# EAGLE design Work In Progress (EAGLE 9.6.2)
CNAME: HAL Circuitry; CREVISION: 0.9; DESIGNER: Thomas G and Andrew F

## Sheet 1 of 5: Arduino and Proto-boards
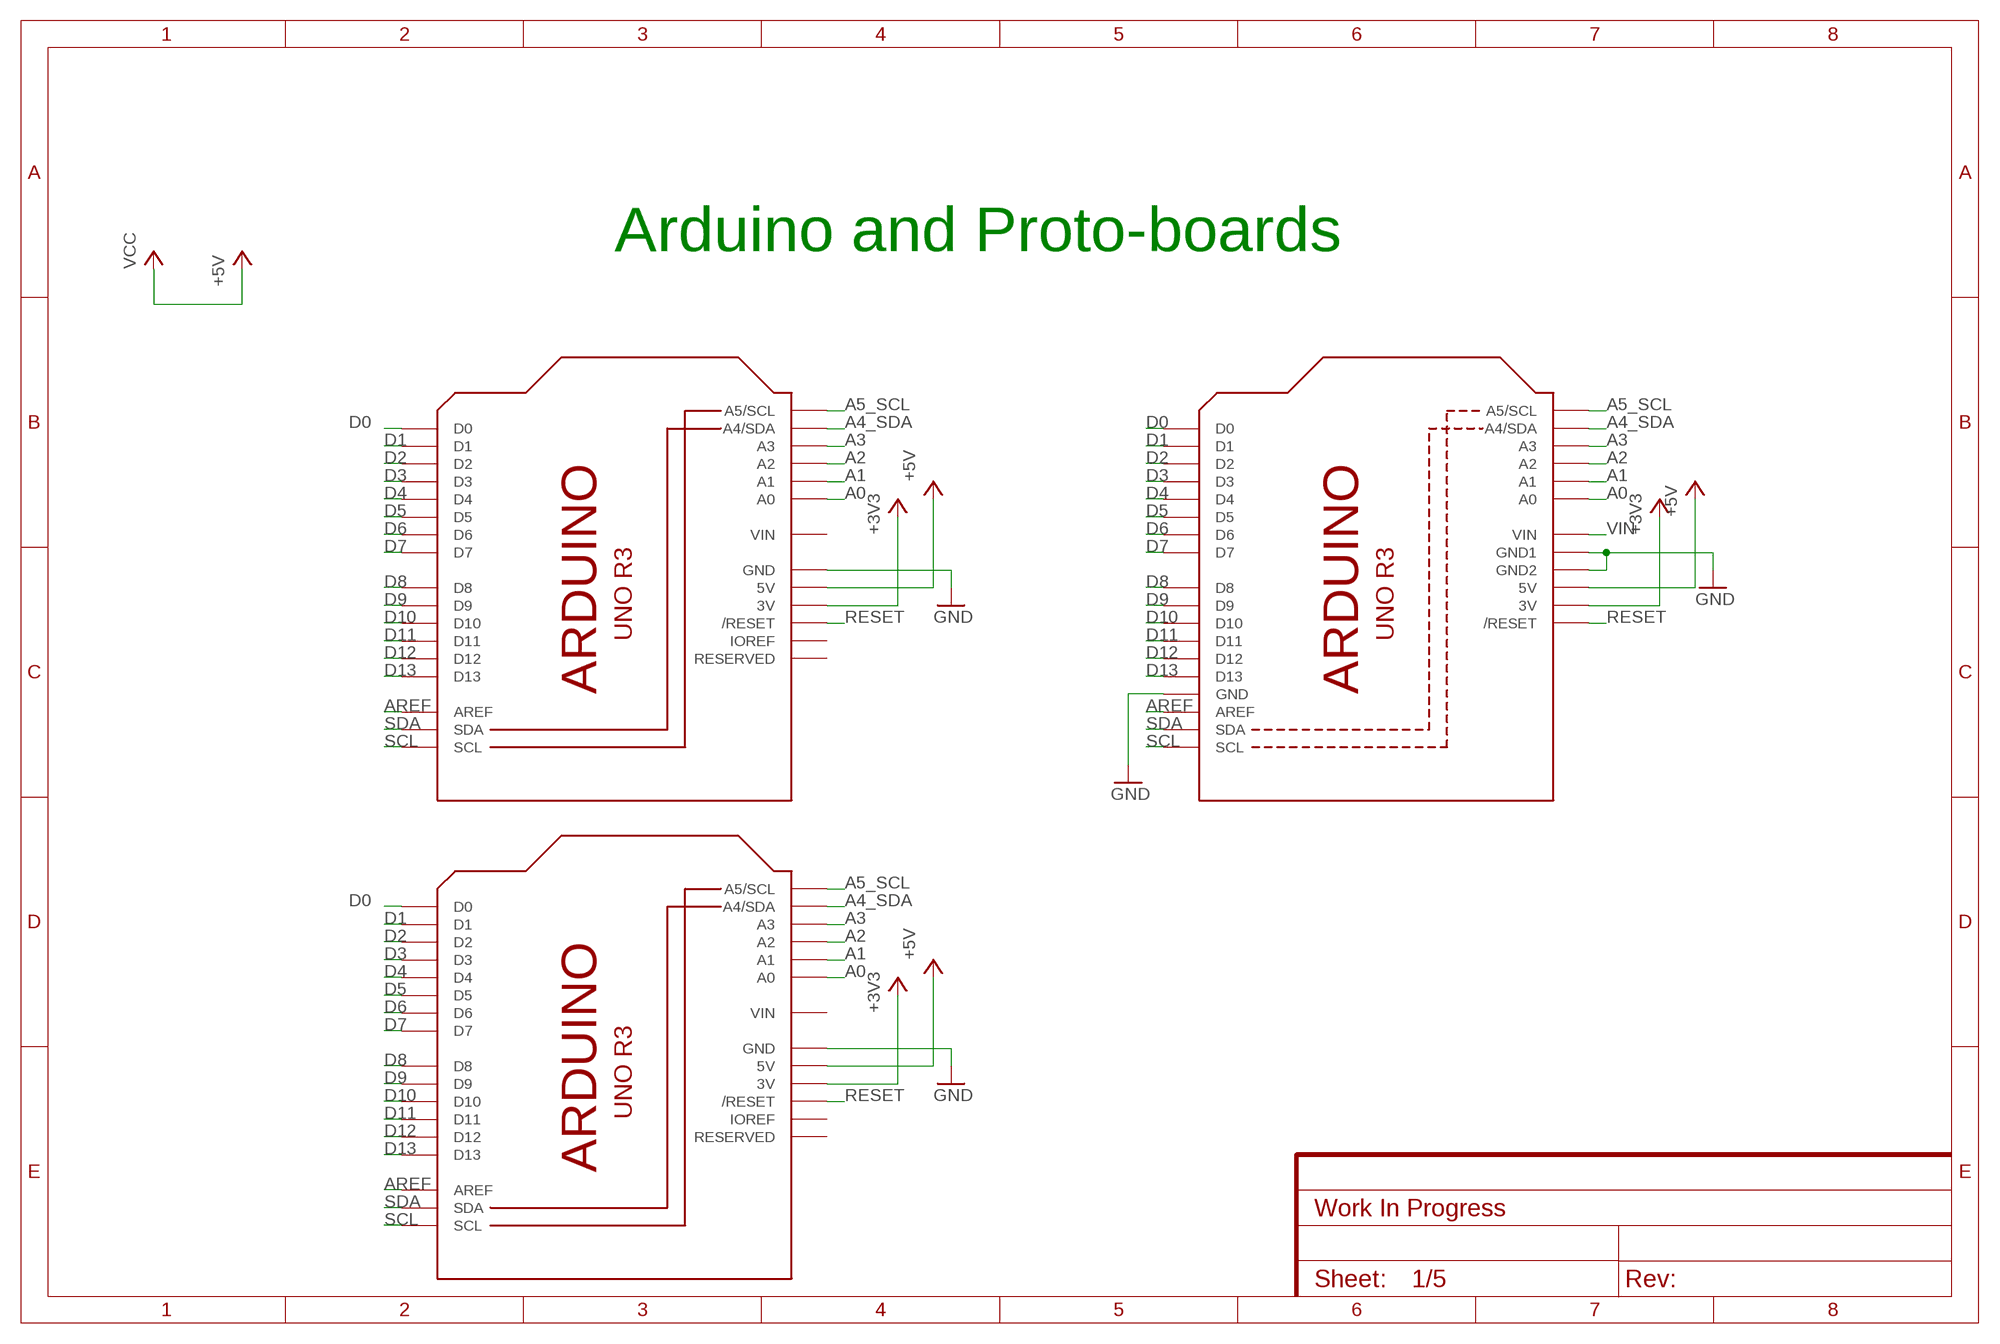
[diagram p0: schematic, sheet 1]

### Parts
M1  IDP_PROTOBOARD_LARGE_LARGE  [IDP_PROTO_LARGE]
M2  IDP_PROTOBOARD_LARGE_LARGE  [IDP_PROTO_LARGE]
Q1  ARDUINOR3-NOIOREF-NOTEXT  [ARDUINOR3-NOTEXT-NOIOREF]

### Nets
+3V3: M1.3V M2.3V Q1.3V
+5V: M1.5V M1.5V@0(5V) M1.5V@1(5V) M1.5V@2(5V) M1.5V@3(5V) M1.5V@4(5V) M1.5V@5(5V) M1.5V@6(5V) M1.5V@7(5V) M1.5V@8(5V) M1.5V@9(5V) M1.5V@10(5V) M1.5V@11(5V) M1.5V@12(5V) M1.5V@13(5V) M1.5V@14(5V) M1.5V@15(5V) M1.5V@16(5V) M1.5V@17(5V) M1.5V@18(5V) M1.5V@19(5V) M1.5V@20(5V) M1.5V@21(5V) M1.5V@22(5V) M1.5V@23(5V) M1.5V@24(5V) M1.5V@25(5V) M1.5V@26(5V) M1.5V@27(5V) M1.5V@28(5V) M1.5V@29(5V) M1.5V@30(5V) M1.5V@31(5V) M1.5V@32(5V) M1.5V@33(5V) M1.5V@34(5V) M1.5V@35(5V) M1.5V@36(5V) M1.5V@37(5V) M1.5V@38(5V) M1.5V@39(5V) M1.5V@40(5V) M1.5V@41(5V) M1.5V@42(5V) M1.5V@43(5V) M1.5V@44(5V) M1.5V@45(5V) M1.5V@46(5V) M1.5V@47(5V) M1.5V@48(5V) M1.5V@49(5V) M1.5V@50(5V) M1.5V@51(5V) M1.5V@52(5V) M1.5V@53(5V) M1.5V@54(5V) M1.5V@55(5V) M1.5V@56(5V) M1.5V@57(5V) M1.5V@58(5V) M1.5V@59(5V) M1.5V@60(5V) M1.5V@61(5V) M1.5V@62(5V) M1.5V@63(5V) M1.5V@64(5V) M1.5V@65(5V) M1.5V@66(5V) M1.5V@67(5V) M1.5V@68(5V) M1.5V@69(5V) M1.5V@70(5V) M2.5V M2.5V@0(5V) M2.5V@1(5V) M2.5V@2(5V) M2.5V@3(5V) M2.5V@4(5V) M2.5V@5(5V) M2.5V@6(5V) M2.5V@7(5V) M2.5V@8(5V) M2.5V@9(5V) M2.5V@10(5V) M2.5V@11(5V) M2.5V@12(5V) M2.5V@13(5V) M2.5V@14(5V) M2.5V@15(5V) M2.5V@16(5V) M2.5V@17(5V) M2.5V@18(5V) M2.5V@19(5V) M2.5V@20(5V) M2.5V@21(5V) M2.5V@22(5V) M2.5V@23(5V) M2.5V@24(5V) M2.5V@25(5V) M2.5V@26(5V) M2.5V@27(5V) M2.5V@28(5V) M2.5V@29(5V) M2.5V@30(5V) M2.5V@31(5V) M2.5V@32(5V) M2.5V@33(5V) M2.5V@34(5V) M2.5V@35(5V) M2.5V@36(5V) M2.5V@37(5V) M2.5V@38(5V) M2.5V@39(5V) M2.5V@40(5V) M2.5V@41(5V) M2.5V@42(5V) M2.5V@43(5V) M2.5V@44(5V) M2.5V@45(5V) M2.5V@46(5V) M2.5V@47(5V) M2.5V@48(5V) M2.5V@49(5V) M2.5V@50(5V) M2.5V@51(5V) M2.5V@52(5V) M2.5V@53(5V) M2.5V@54(5V) M2.5V@55(5V) M2.5V@56(5V) M2.5V@57(5V) M2.5V@58(5V) M2.5V@59(5V) M2.5V@60(5V) M2.5V@61(5V) M2.5V@62(5V) M2.5V@63(5V) M2.5V@64(5V) M2.5V@65(5V) M2.5V@66(5V) M2.5V@67(5V) M2.5V@68(5V) M2.5V@69(5V) M2.5V@70(5V) Q1.5V ; supply symbol labelled VCC ; also sheet 2,3,4
A0: M1.A0 M2.A0 Q1.A0
A1: M1.A1 M2.A1 Q1.A1
A2: M1.A2 M2.A2 Q1.A2
A3: M1.A3 M2.A3 Q1.A3
A4_SDA: M1.A4(A4/SDA) M2.A4(A4/SDA) Q1.A4(A4/SDA)
A5_SCL: M1.A5(A5/SCL) M2.A5(A5/SCL) Q1.A5(A5/SCL)
AREF: M1.AREF M2.AREF Q1.AREF
D0: M1.D0 M2.D0 Q1.D0
D1: M1.D1 M2.D1 Q1.D1 ; also sheet 4
D2: M1.D2 M2.D2 Q1.D2 ; also sheet 2,4
D3: M1.D3 M2.D3 Q1.D3 ; also sheet 4
D4: M1.D4 M2.D4 Q1.D4 ; also sheet 4
D5: M1.D5 M2.D5 Q1.D5
D6: M1.D6 M2.D6 Q1.D6
D7: M1.D7 M2.D7 Q1.D7
D8: M1.D8 M2.D8 Q1.D8 ; also sheet 3
D9: M1.D9 M2.D9 Q1.D9 ; also sheet 3
D10: M1.D10 M2.D10 Q1.D10 ; also sheet 3
D11: M1.D11 M2.D11 Q1.D11 ; also sheet 3
D12: M1.D12 M2.D12 Q1.D12
D13: M1.D13 M2.D13 Q1.D13
GND: M1.GND M1.GND1(GND) M1.GND2(GND) M1.GND3(GND) M1.GND4(GND) M1.GND5(GND) M1.GND6(GND) M1.GND7(GND) M1.GND8(GND) M1.GND9(GND) M1.GND10(GND) M1.GND11(GND) M1.GND12(GND) M1.GND13(GND) M1.GND14(GND) M1.GND15(GND) M1.GND16(GND) M1.GND17(GND) M1.GND18(GND) M1.GND19(GND) M1.GND20(GND) M1.GND21(GND) M1.GND22(GND) M1.GND23(GND) M1.GND24(GND) M1.GND25(GND) M1.GND26(GND) M1.GND27(GND) M1.GND28(GND) M1.GND29(GND) M1.GND30(GND) M1.GND31(GND) M1.GND32(GND) M1.GND33(GND) M1.GND@1(GND) M1.GND@2(GND) M1.GND@3(GND) M1.GND@4(GND) M1.GND@5(GND) M1.GND@6(GND) M1.GND@7(GND) M1.GND@8(GND) M1.GND@9(GND) M1.GND@10(GND) M1.GND@11(GND) M1.GND@12(GND) M1.GND@13(GND) M1.GND@14(GND) M1.GND@15(GND) M1.GND@16(GND) M1.GND@17(GND) M1.GND@26(GND) M1.GND@27(GND) M1.GND@28(GND) M1.GND@29(GND) M1.GND@30(GND) M1.GND@31(GND) M1.GND@32(GND) M1.GND@33(GND) M1.GND@34(GND) M1.GND@35(GND) M1.GND@36(GND) M1.GND@37(GND) M1.GND@38(GND) M1.GND@39(GND) M1.GND@40(GND) M1.GND@41(GND) M1.GND@42(GND) M1.GND@43(GND) M1.GND@44(GND) M1.GND@45(GND) M1.GND@46(GND) M1.GND@47(GND) M1.GND@48(GND) M2.GND M2.GND1(GND) M2.GND2(GND) M2.GND3(GND) M2.GND4(GND) M2.GND5(GND) M2.GND6(GND) M2.GND7(GND) M2.GND8(GND) M2.GND9(GND) M2.GND10(GND) M2.GND11(GND) M2.GND12(GND) M2.GND13(GND) M2.GND14(GND) M2.GND15(GND) M2.GND16(GND) M2.GND17(GND) M2.GND18(GND) M2.GND19(GND) M2.GND20(GND) M2.GND21(GND) M2.GND22(GND) M2.GND23(GND) M2.GND24(GND) M2.GND25(GND) M2.GND26(GND) M2.GND27(GND) M2.GND28(GND) M2.GND29(GND) M2.GND30(GND) M2.GND31(GND) M2.GND32(GND) M2.GND33(GND) M2.GND@1(GND) M2.GND@2(GND) M2.GND@3(GND) M2.GND@4(GND) M2.GND@5(GND) M2.GND@6(GND) M2.GND@7(GND) M2.GND@8(GND) M2.GND@9(GND) M2.GND@10(GND) M2.GND@11(GND) M2.GND@12(GND) M2.GND@13(GND) M2.GND@14(GND) M2.GND@15(GND) M2.GND@16(GND) M2.GND@17(GND) M2.GND@26(GND) M2.GND@27(GND) M2.GND@28(GND) M2.GND@29(GND) M2.GND@30(GND) M2.GND@31(GND) M2.GND@32(GND) M2.GND@33(GND) M2.GND@34(GND) M2.GND@35(GND) M2.GND@36(GND) M2.GND@37(GND) M2.GND@38(GND) M2.GND@39(GND) M2.GND@40(GND) M2.GND@41(GND) M2.GND@42(GND) M2.GND@43(GND) M2.GND@44(GND) M2.GND@45(GND) M2.GND@46(GND) M2.GND@47(GND) M2.GND@48(GND) Q1.GND Q1.GND1 Q1.GND2 ; also sheet 2,3,4
RESET: M1.RESET(/RESET) M2.RESET(/RESET) Q1.RESET(/RESET)
SCL: M1.SCL M2.SCL Q1.SCL
SDA: M1.SDA M2.SDA Q1.SDA
VIN: Q1.VIN
Unconnected: M1.IOREF M1.RESERVED M1.VIN M2.IOREF M2.RESERVED M2.VIN

### Notes on the sheet
- Arduino and Proto-boards

## Sheet 2 of 5: 2Hz Amber LED Blinking Circuit
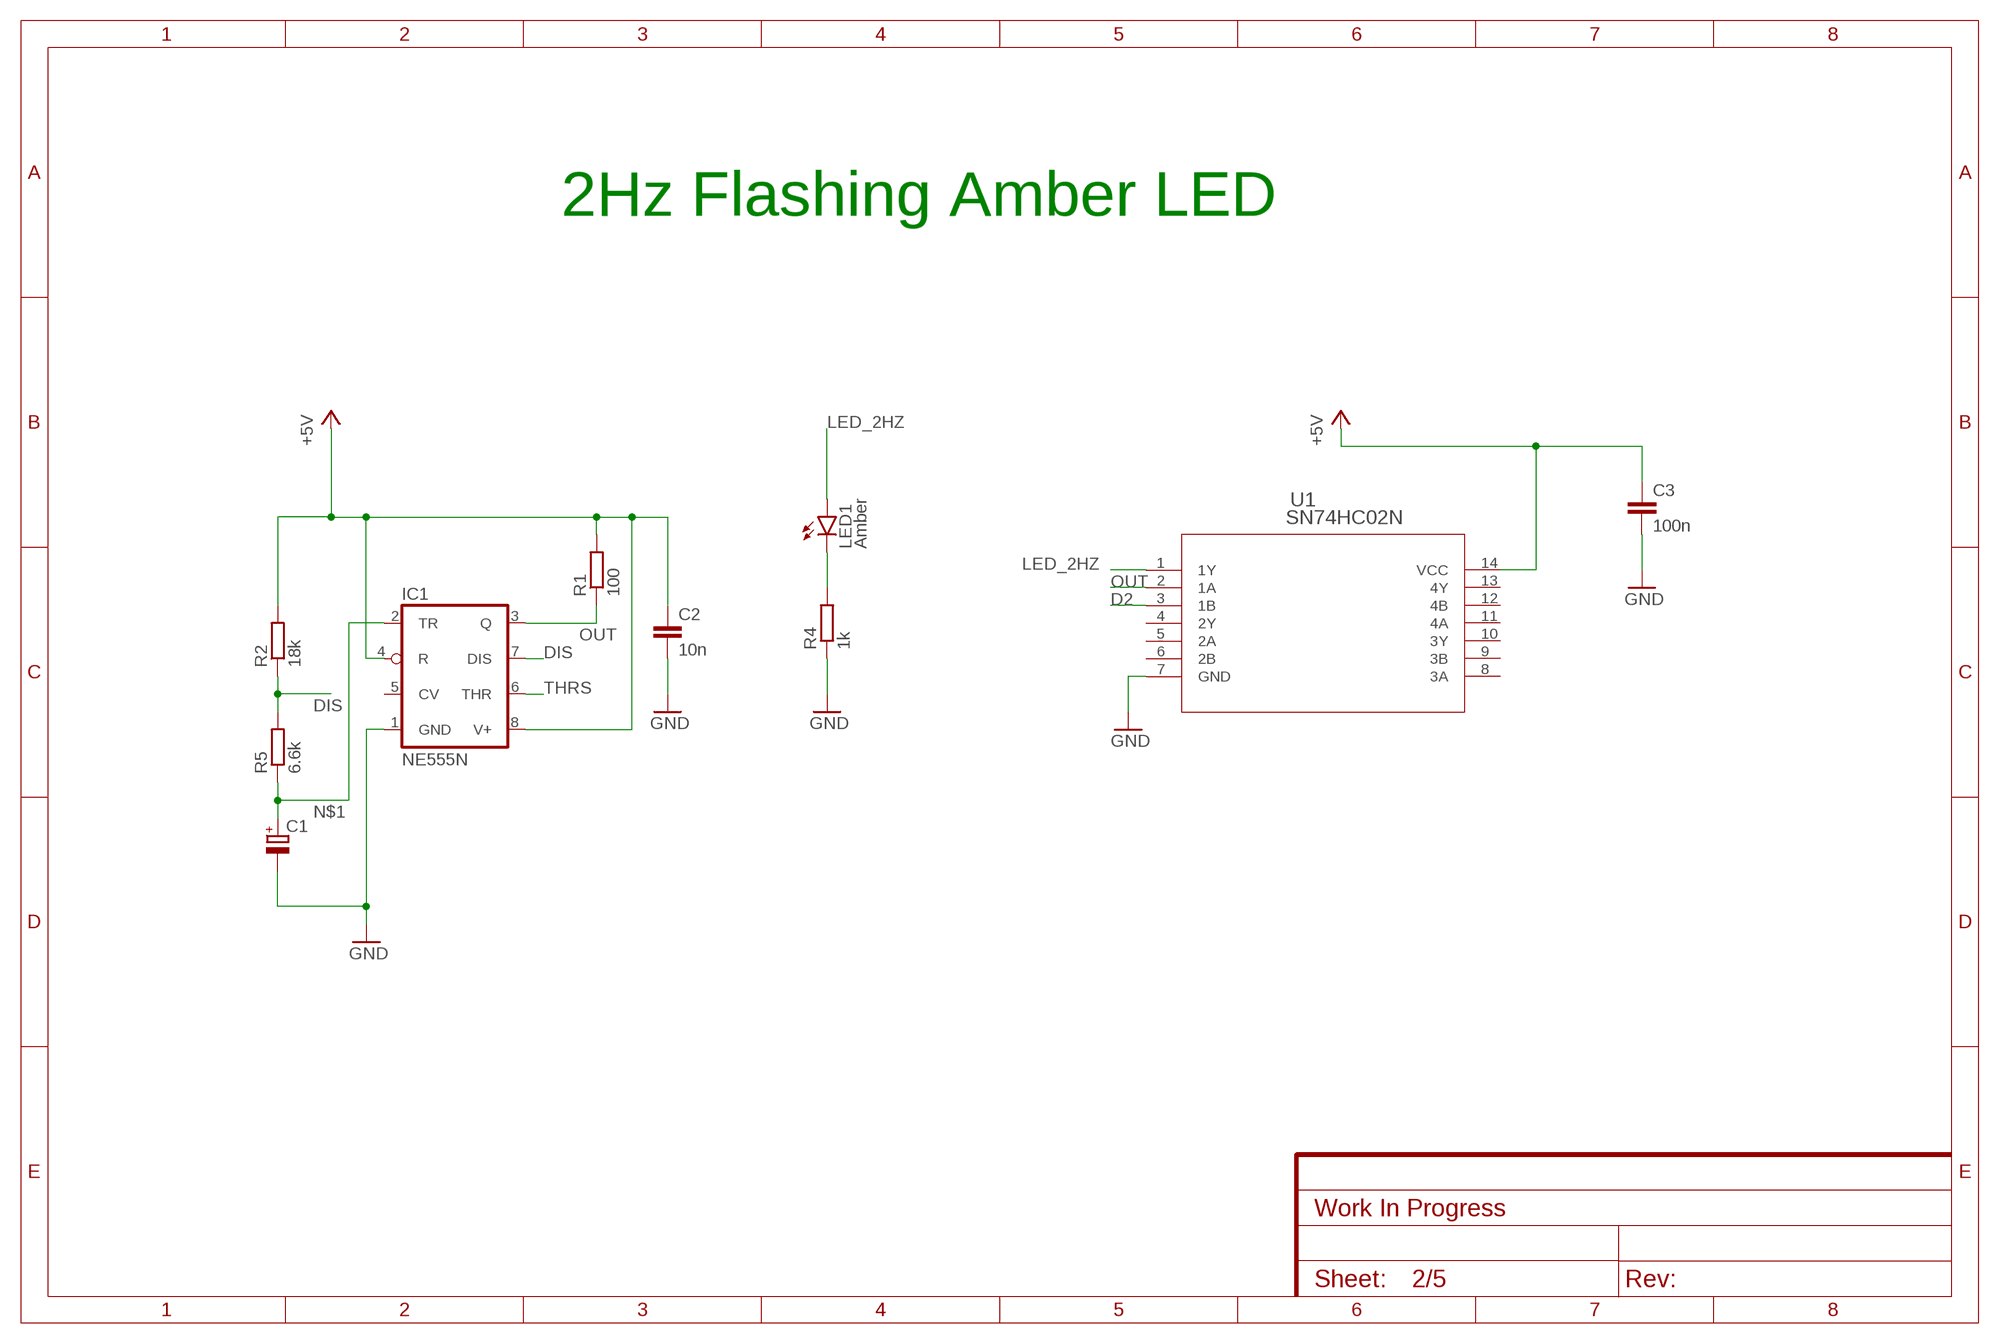
[diagram p1: schematic, sheet 2]

### Parts
C1  CPOL-EUTT2D4  [TT2D4]
C2  10n  C-EU025-024X044  [C025-024X044]
C3  100n  C-EU025-024X044  [C025-024X044]
IC1  NE555N  [DIL08-ROUND]
LED1  Amber  LED_23MM  [LED3MM]
R1  100  R-EU_0204/2V  [0204V]
R2  18k  R-EU_0204/2V  [0204V]
R4  1k  R-EU_0204/2V  [0204V]
R5  6.6k  R-EU_0204/2V  [0204V]
U1  SN74HC02N  [N14]

### Nets
+5V: C2.1 C3.1 IC1.4(R) IC1.8(V+) R1.2 R2.2 U1.14(VCC) ; also sheet 1,3,4
D2: U1.3(1B) ; also sheet 1,4
DIS: IC1.7(DIS) R2.1 R5.2
GND: C1.- C2.2 C3.2 IC1.1(GND) R4.1 U1.7(GND) ; also sheet 1,3,4
LED_2HZ: LED1.A U1.1(1Y)
N$1: C1.+ IC1.2(TR) R5.1
N$3: LED1.K(C) R4.2
OUT: IC1.3(Q) R1.1 U1.2(1A)
THRS: IC1.6(THR)
Unconnected: IC1.5(CV) U1.4(2Y) U1.5(2A) U1.6(2B) U1.8(3A) U1.9(3B) U1.10(3Y) U1.11(4A) U1.12(4B) U1.13(4Y)

### Notes on the sheet
- 2Hz Flashing Amber LED

## Sheet 3 of 5: Additional Sensors and Circuitry
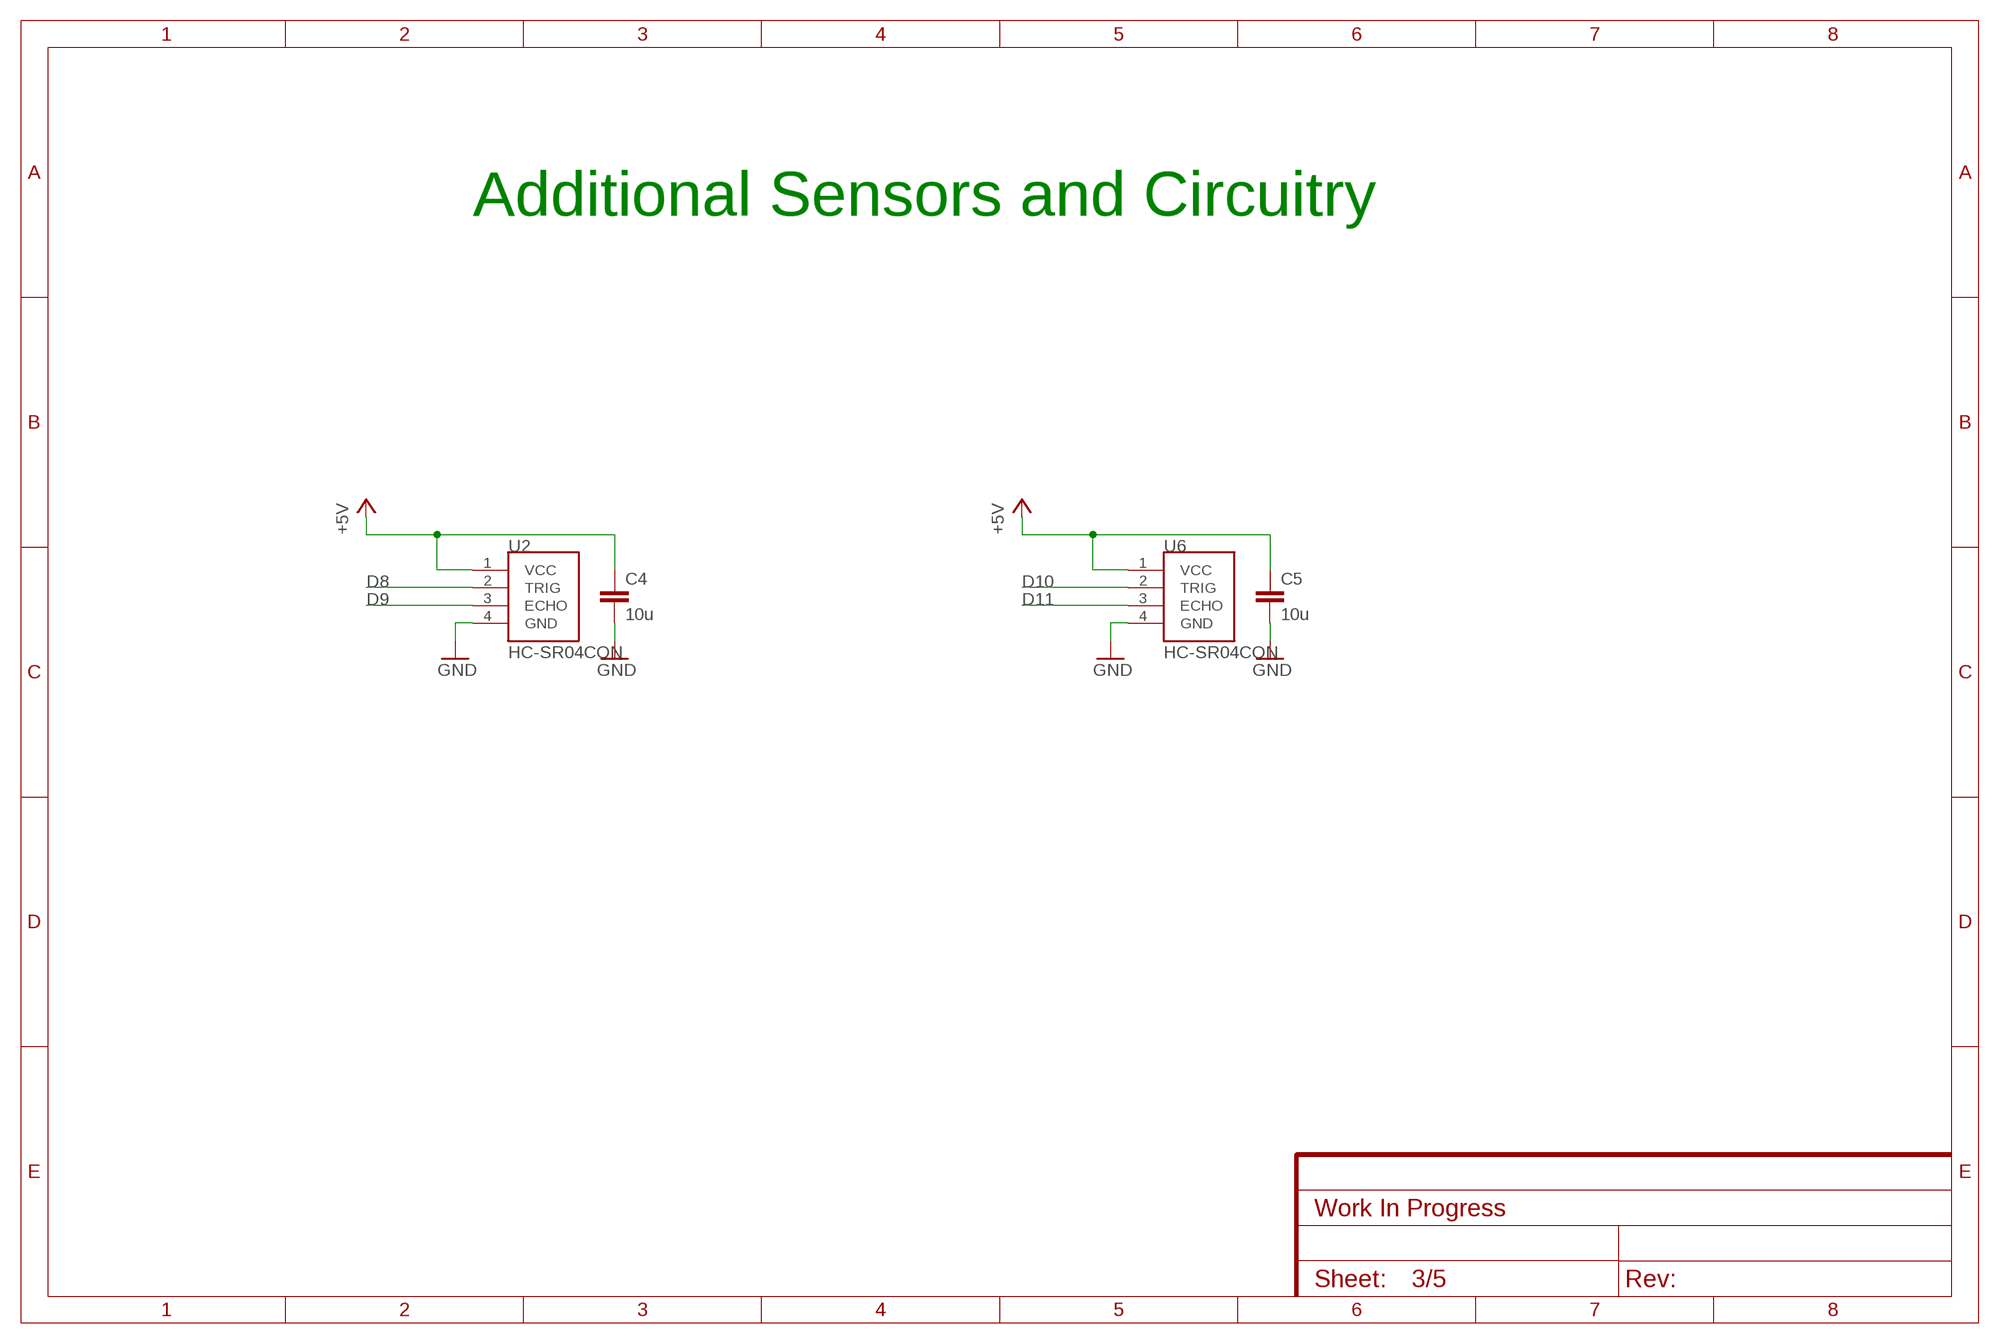
[diagram p2: schematic, sheet 3]

### Parts
C4  10u  C-EU025-024X044  [C025-024X044]
C5  10u  C-EU025-024X044  [C025-024X044]
U2  HC-SR04CON  [22-23-2041]
U6  HC-SR04CON  [22-23-2041]

### Nets
+5V: C4.1 C5.1 U2.1(VCC) U6.1(VCC) ; also sheet 1,2,4
D8: U2.2(TRIG) ; also sheet 1
D9: U2.3(ECHO) ; also sheet 1
D10: U6.2(TRIG) ; also sheet 1
D11: U6.3(ECHO) ; also sheet 1
GND: C4.2 C5.2 U2.4(GND) U6.4(GND) ; also sheet 1,2,4

### Notes on the sheet
- Additional Sensors and Circuitry

## Sheet 4 of 5: Line Following
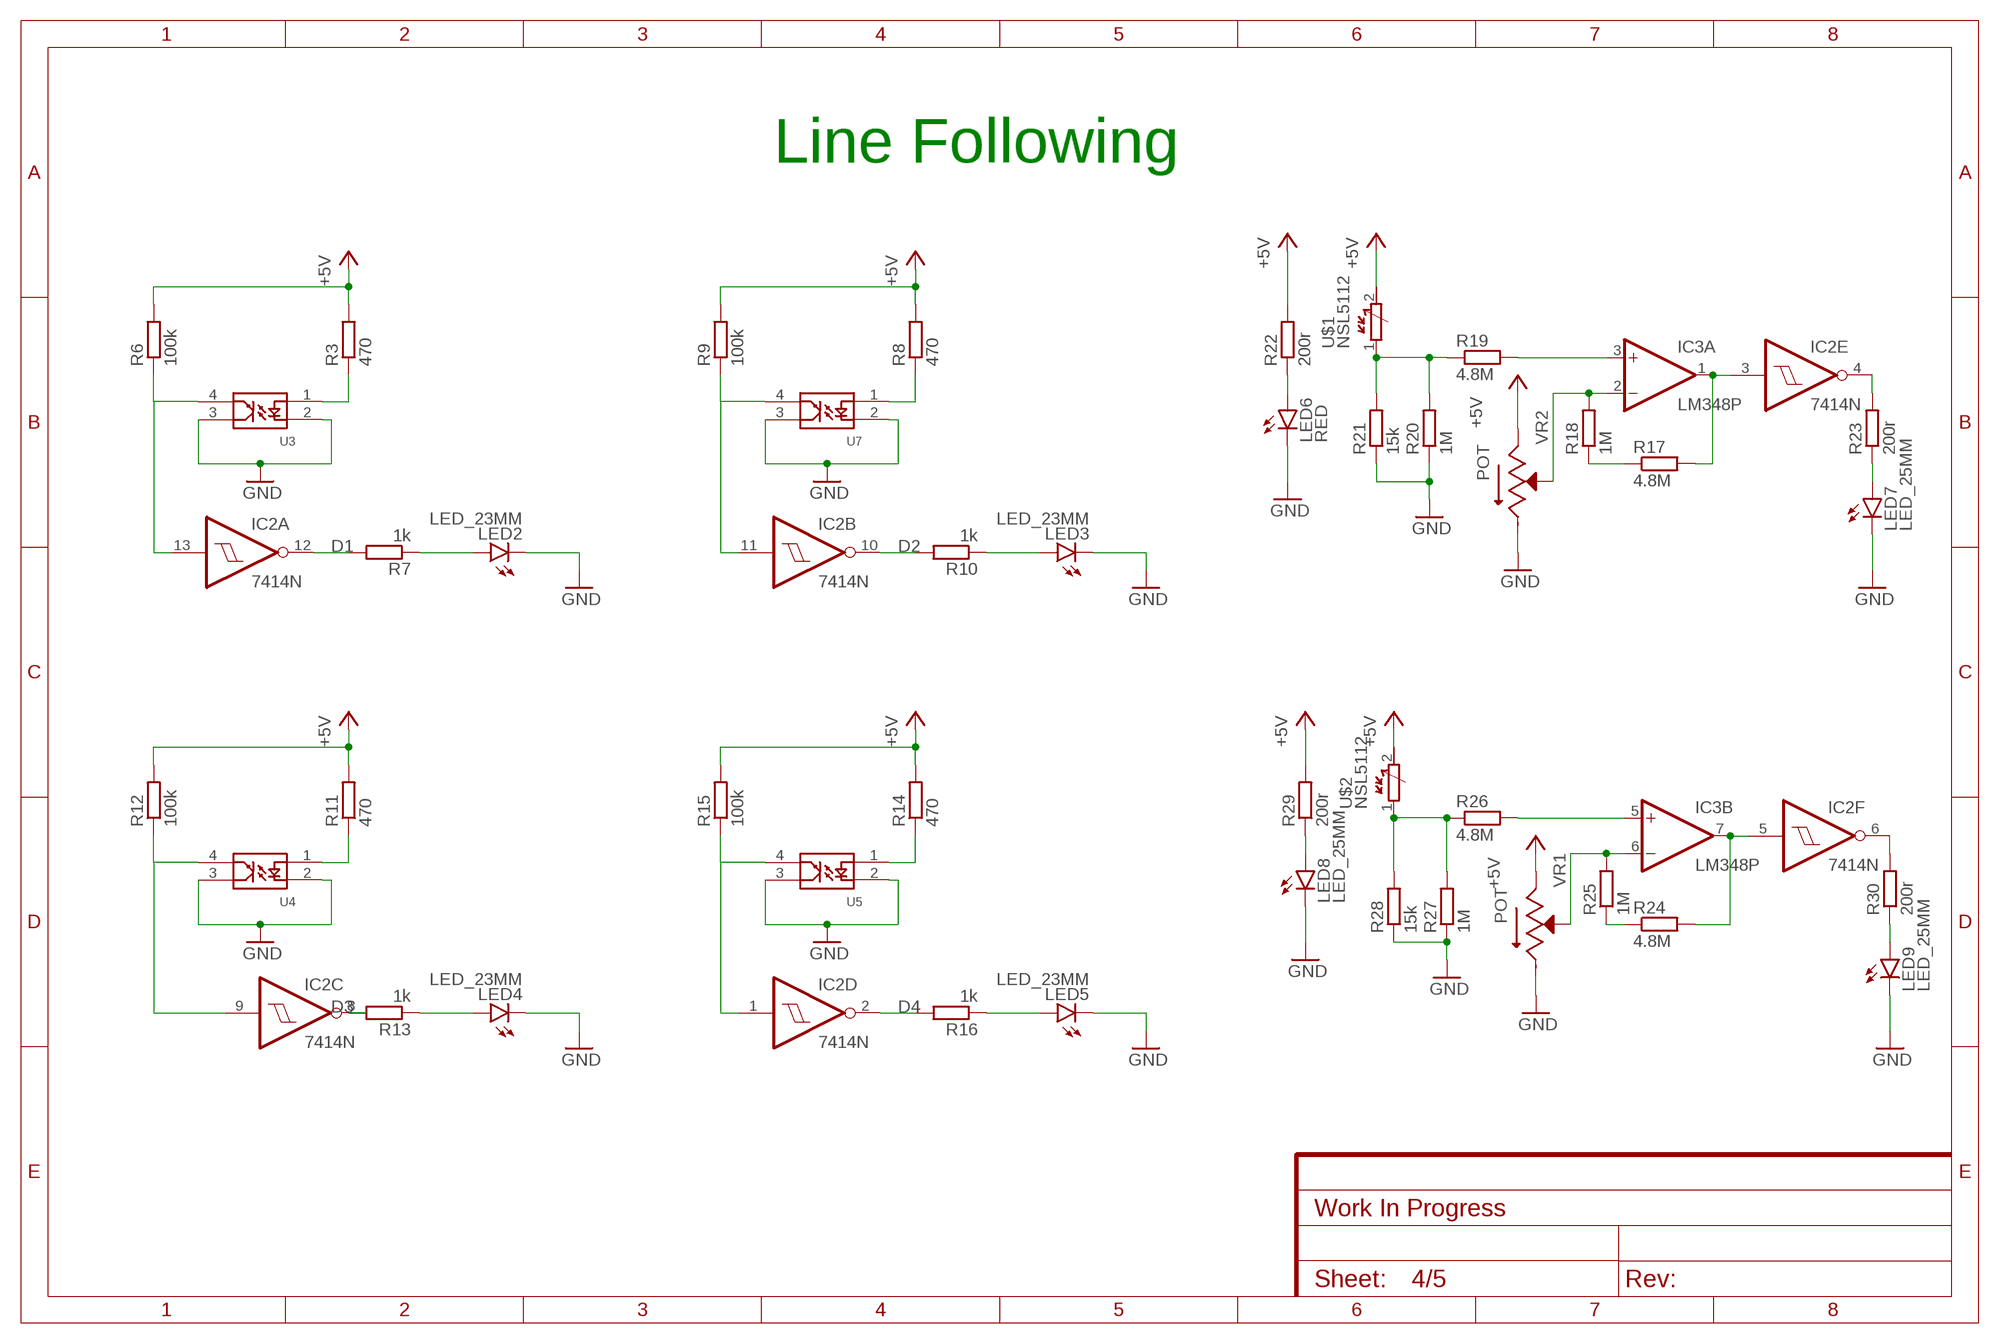
[diagram p3: schematic, sheet 4]

### Parts
IC2  7414N  [DIL14]
IC3  LM348P  [DIL14]
LED2  LED_23MM  [LED3MM]
LED3  LED_23MM  [LED3MM]
LED4  LED_23MM  [LED3MM]
LED5  LED_23MM  [LED3MM]
LED6  RED  LED_25MM  [LED5MM]
LED7  LED_25MM  [LED5MM]
LED8  LED_25MM  [LED5MM]
LED9  LED_25MM  [LED5MM]
R3  470  R-EU_0204/2V  [0204V]
R6  100k  R-EU_0204/2V  [0204V]
R7  1k  R-EU_0204/2V  [0204V]
R8  470  R-EU_0204/2V  [0204V]
R9  100k  R-EU_0204/2V  [0204V]
R10  1k  R-EU_0204/2V  [0204V]
R11  470  R-EU_0204/2V  [0204V]
R12  100k  R-EU_0204/2V  [0204V]
R13  1k  R-EU_0204/2V  [0204V]
R14  470  R-EU_0204/2V  [0204V]
R15  100k  R-EU_0204/2V  [0204V]
R16  1k  R-EU_0204/2V  [0204V]
R17  4.8M  R-EU_0204/2V  [0204V]
R18  1M  R-EU_0204/2V  [0204V]
R19  4.8M  R-EU_0204/2V  [0204V]
R20  1M  R-EU_0204/2V  [0204V]
R21  15k  R-EU_0204/2V  [0204V]
R22  200r  R-EU_0204/2V  [0204V]
R23  200r  R-EU_0204/2V  [0204V]
R24  4.8M  R-EU_0204/2V  [0204V]
R25  1M  R-EU_0204/2V  [0204V]
R26  4.8M  R-EU_0204/2V  [0204V]
R27  1M  R-EU_0204/2V  [0204V]
R28  15k  R-EU_0204/2V  [0204V]
R29  200r  R-EU_0204/2V  [0204V]
R30  200r  R-EU_0204/2V  [0204V]
U3  OPB704  [22-23-2041]
U4  OPB704  [22-23-2041]
U5  OPB704  [22-23-2041]
U7  OPB704  [22-23-2041]
U$1  NSL5112  [KK-156-2]
U$2  NSL5112  [KK-156-2]
VR1  POT  [TRIM_3296W-1-250]
VR2  POT  [TRIM_3296W-1-250]

### Nets
+5V: R3.2 R6.2 R8.2 R9.2 R11.2 R12.2 R14.2 R15.2 R22.2 R29.2 U$1.2(E) U$2.2(E) VR1.1(CCW) VR2.1(CCW) ; also sheet 1,2,3
D1: IC2.12(A:O) R7.2 ; also sheet 1
D2: IC2.10(B:O) R10.2 ; also sheet 1,2
D3: IC2.8(C:O) R13.2 ; also sheet 1
D4: IC2.2(D:O) R16.2 ; also sheet 1
GND: LED2.K(C) LED3.K(C) LED4.K(C) LED5.K(C) LED6.K(C) LED7.K(C) LED8.K(C) LED9.K(C) R20.1 R21.1 R27.1 R28.1 U3.2 U3.3 U4.2 U4.3 U5.2 U5.3 U7.2 U7.3 VR1.3(CW) VR2.3(CW) ; also sheet 1,2,3
N$2: R3.1 U3.1
N$4: LED2.A R7.1
N$5: IC2.13(A:I) R6.1 U3.4
N$6: R8.1 U7.1
N$7: IC2.11(B:I) R9.1 U7.4
N$8: LED3.A R10.1
N$9: R11.1 U4.1
N$10: IC2.9(C:I) R12.1 U4.4
N$11: LED4.A R13.1
N$12: R14.1 U5.1
N$13: IC2.1(D:I) R15.1 U5.4
N$14: LED5.A R16.1
N$15: R17.1 R18.1
N$16: IC2.3(E:I) IC3.1(A:OUT) R17.2
N$17: IC3.2(A:-IN) R18.2 VR2.2(WIPER)
N$18: IC3.3(A:+IN) R19.2
N$19: R19.1 R20.2 R21.2 U$1.1(A)
N$20: LED6.A R22.1
N$21: LED7.A R23.1
N$22: IC2.4(E:O) R23.2
N$23: R24.1 R25.1
N$24: IC2.5(F:I) IC3.7(B:OUT) R24.2
N$25: IC3.6(B:-IN) R25.2 VR1.2(WIPER)
N$26: IC3.5(B:+IN) R26.2
N$27: R26.1 R27.2 R28.2 U$2.1(A)
N$28: LED8.A R29.1
N$29: LED9.A R30.1
N$30: IC2.6(F:O) R30.2
Unconnected: IC3.8(C:OUT) IC3.9(C:-IN) IC3.10(C:+IN) IC3.12(D:+IN) IC3.13(D:-IN) IC3.14(D:OUT)

### Notes on the sheet
- Line Following

## Sheet 5 of 5: Colour Detection
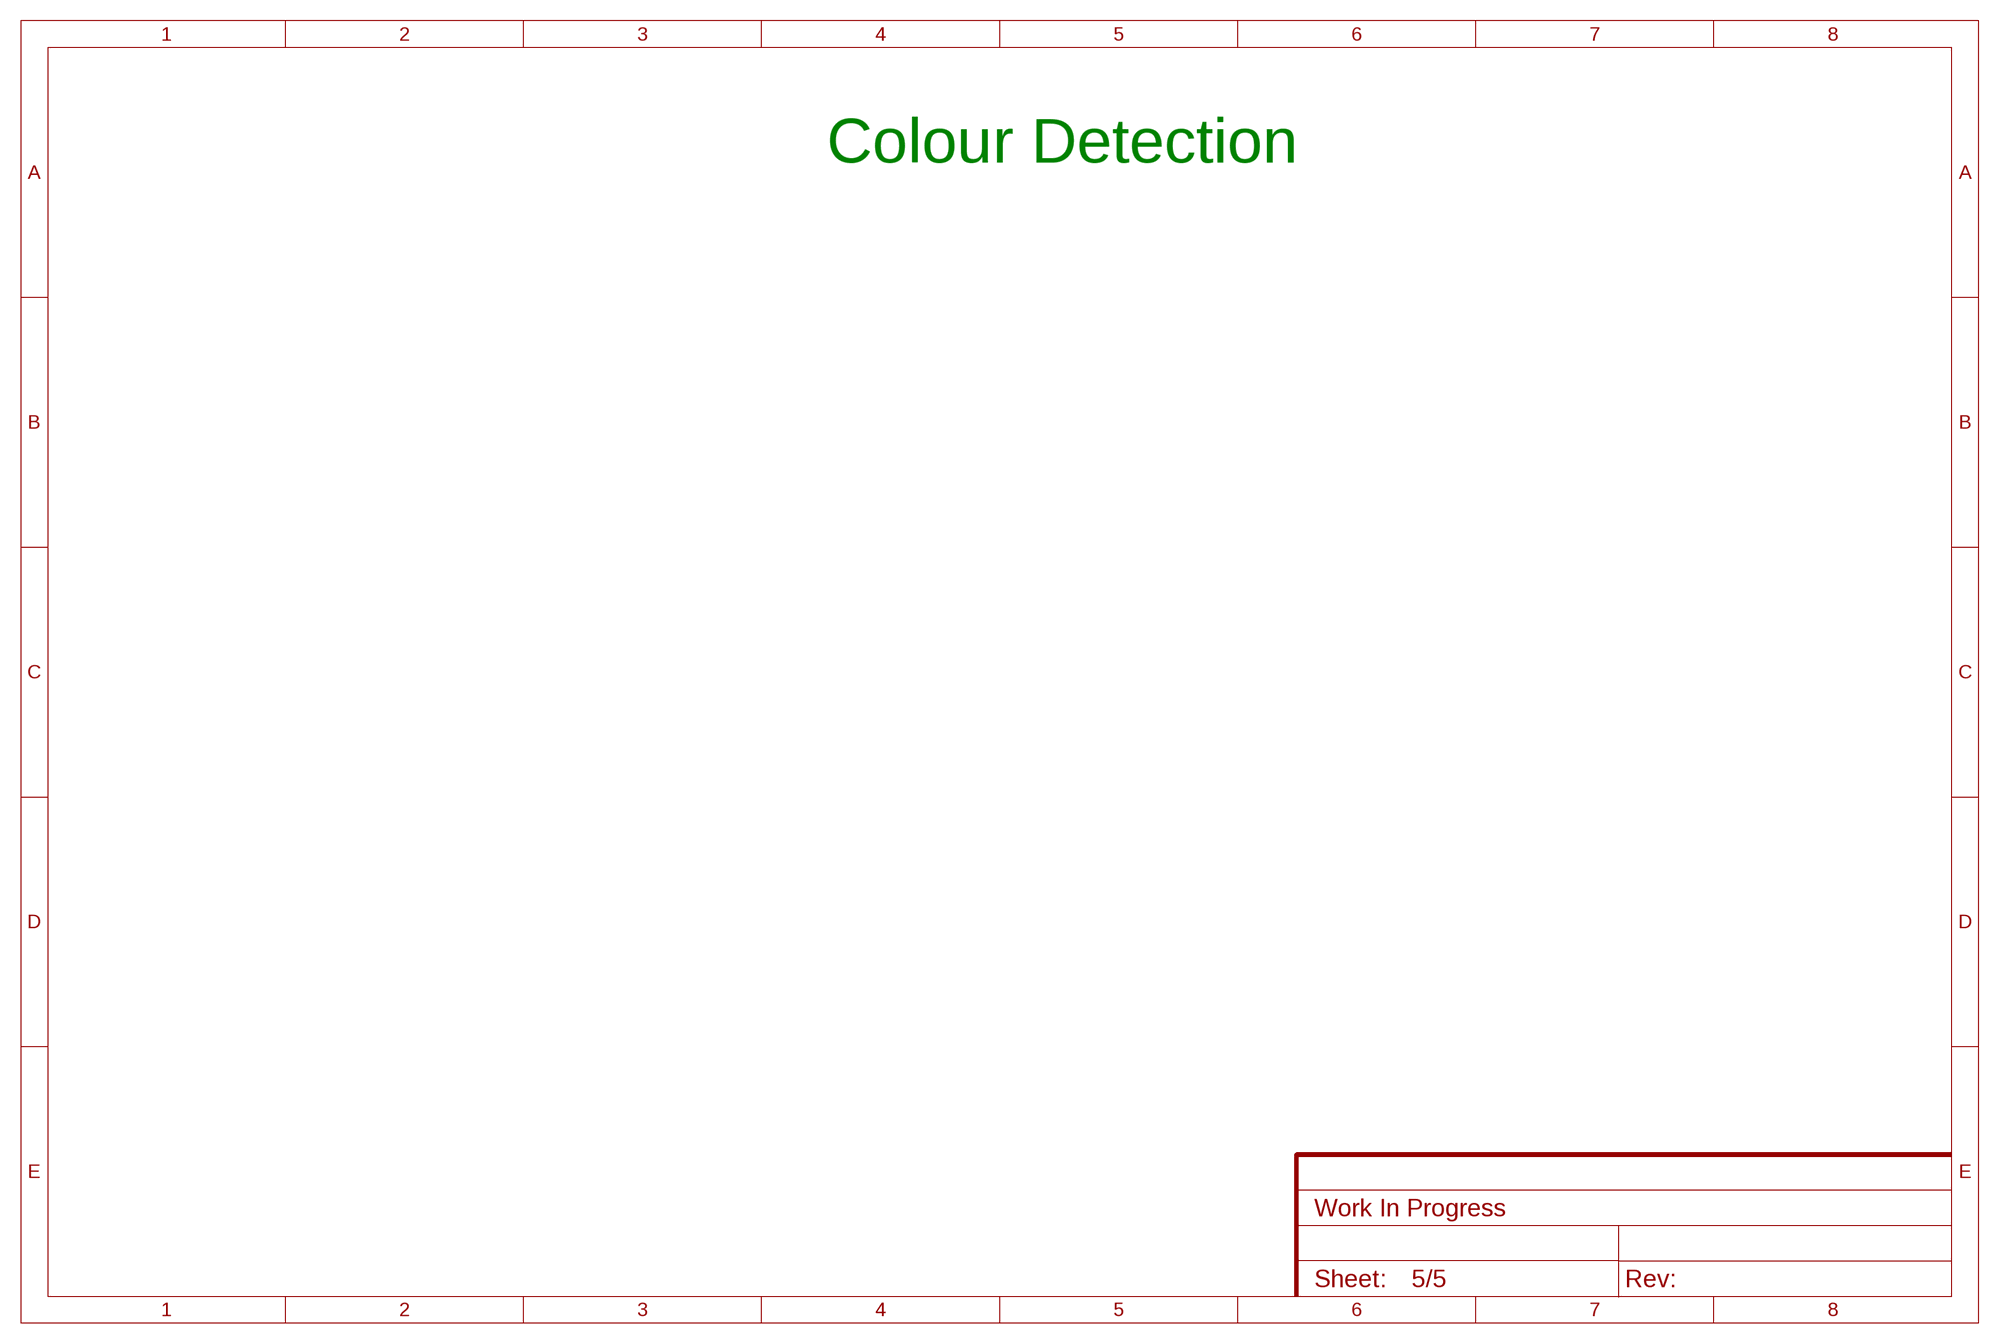
[diagram p4: schematic, sheet 5]

### Notes on the sheet
- Colour Detection

## Power pins joined to a net without a drawn wire
GND: IC2.7(P:GND)
V+: IC3.4(P:V+)
V-: IC3.11(P:V-)
VCC: IC2.14(P:VCC)

## Library data of the parts
C1 = IDP_library:CPOL-EU: POLARIZED CAPACITOR, European symbol; SPICEPREFIX: C
C2-C5 = IDP_library:C-EU: CAPACITOR, European symbol; SPICEPREFIX: C
IC1 = IDP_library:*555: TIMER Changed DIP package to have round (not oval) pin pads http://www.ladyada.net/library/pcb/eaglelibrary.html
IC2 = IDP_library:74*14: Hex schmitt trigger INVERTER
IC3 = IDP_library:LM348: Quad OP AMP
LED1-LED9 = IDP_library:LED_2: LED
M1 M2 = IDP_library:IDP_PROTOBOARD_LARGE
Q1 = IDP_library:ARDUINOR3-NOIOREF
R1-R30 = IDP_library:R-EU_: RESISTOR, European symbol; SPICEPREFIX: R
U1 = IDP_library:SN74HC02N; COPYRIGHT: Copyright (C) 2023 Ultra Librarian. All rights reserved.; MANUFACTURER_PART_NUMBER: SN74HC02N; MFR_NAME: Texas Instruments
U2 U6 = IDP_library:HC-SR04: Ultrasonic Sensor Module Check prices <https://pricing.snapeda.com/parts/HC-SR04/SparkFun%20Electronics/view-part?ref=eda>
U3-U5 U7 = IDP_library:OPB704: 314020022
U$1 U$2 = IDP_library:NSL5112
VR1 VR2 = IDP_library:POT: Res Cermet Trimmer 500K Ohm 10% 0.5W 25(Elec)Turn 2.19mm (9.53 X 4.83 X 11.55mm) Pin Thru-Hole Tube; AVAILABILITY: Unavailable; DESCRIPTION: Trimpot 25 Ohm 3/8 Sq Cer Mt; MF: Bourns; MP: 3296W-1-250; PACKAGE: SOT-23-5 Bourns; PRICE: None

## Board
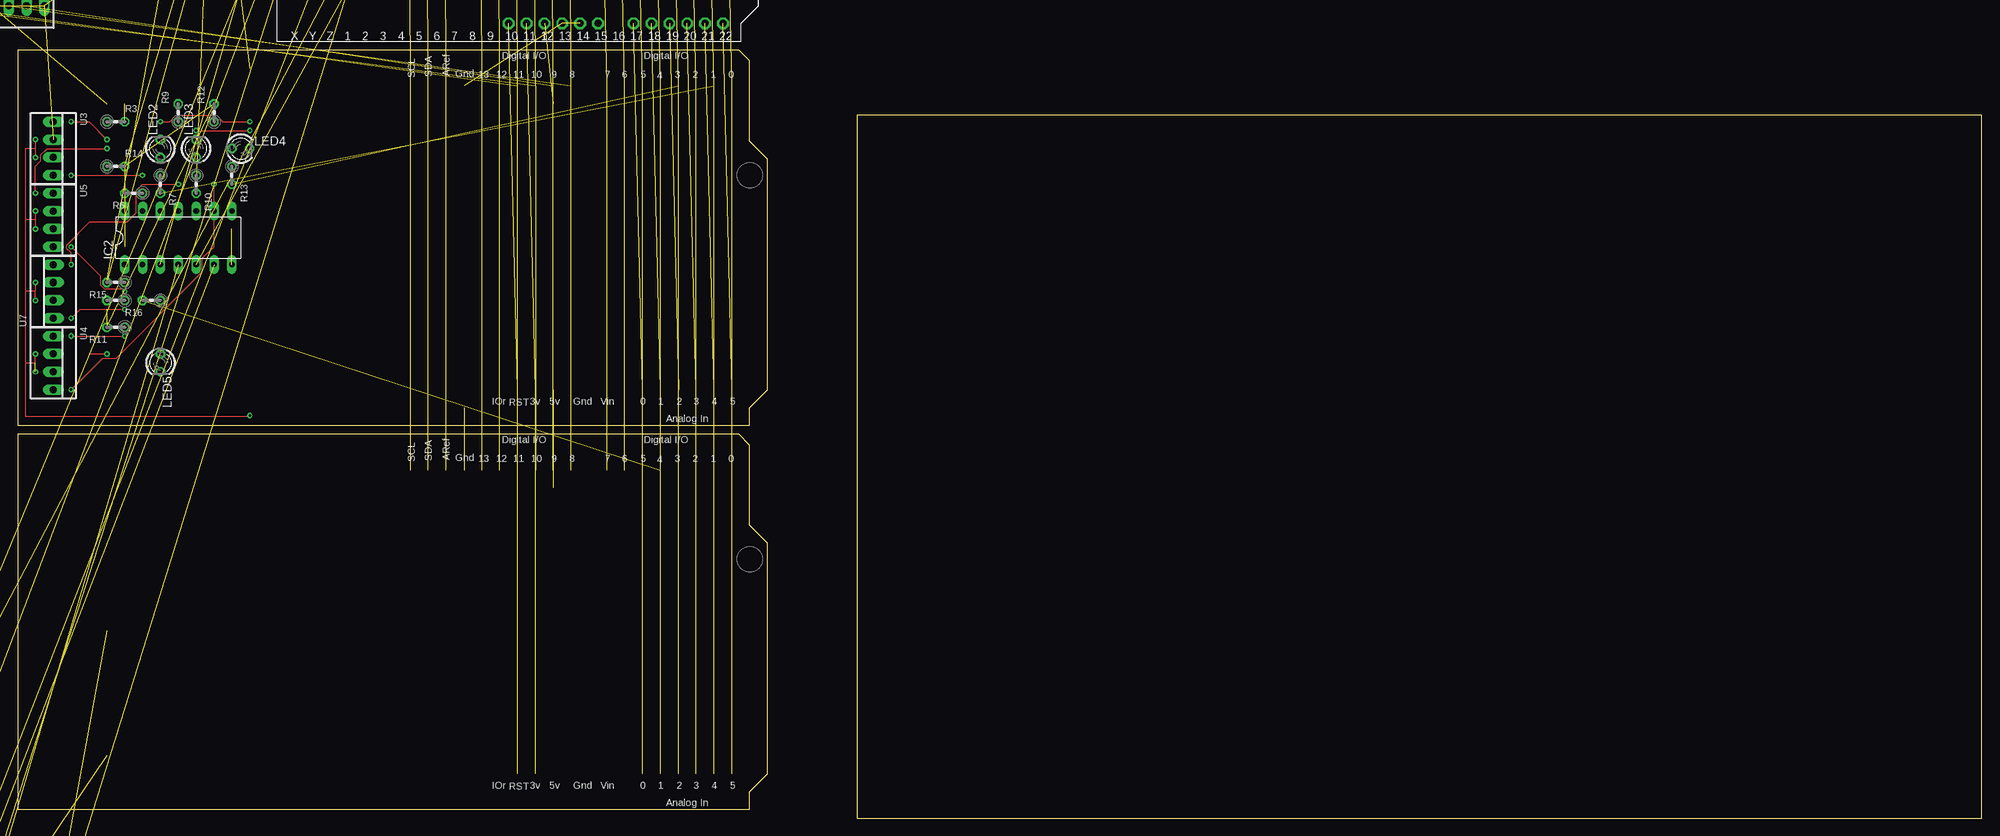
[diagram p5: board, top side]
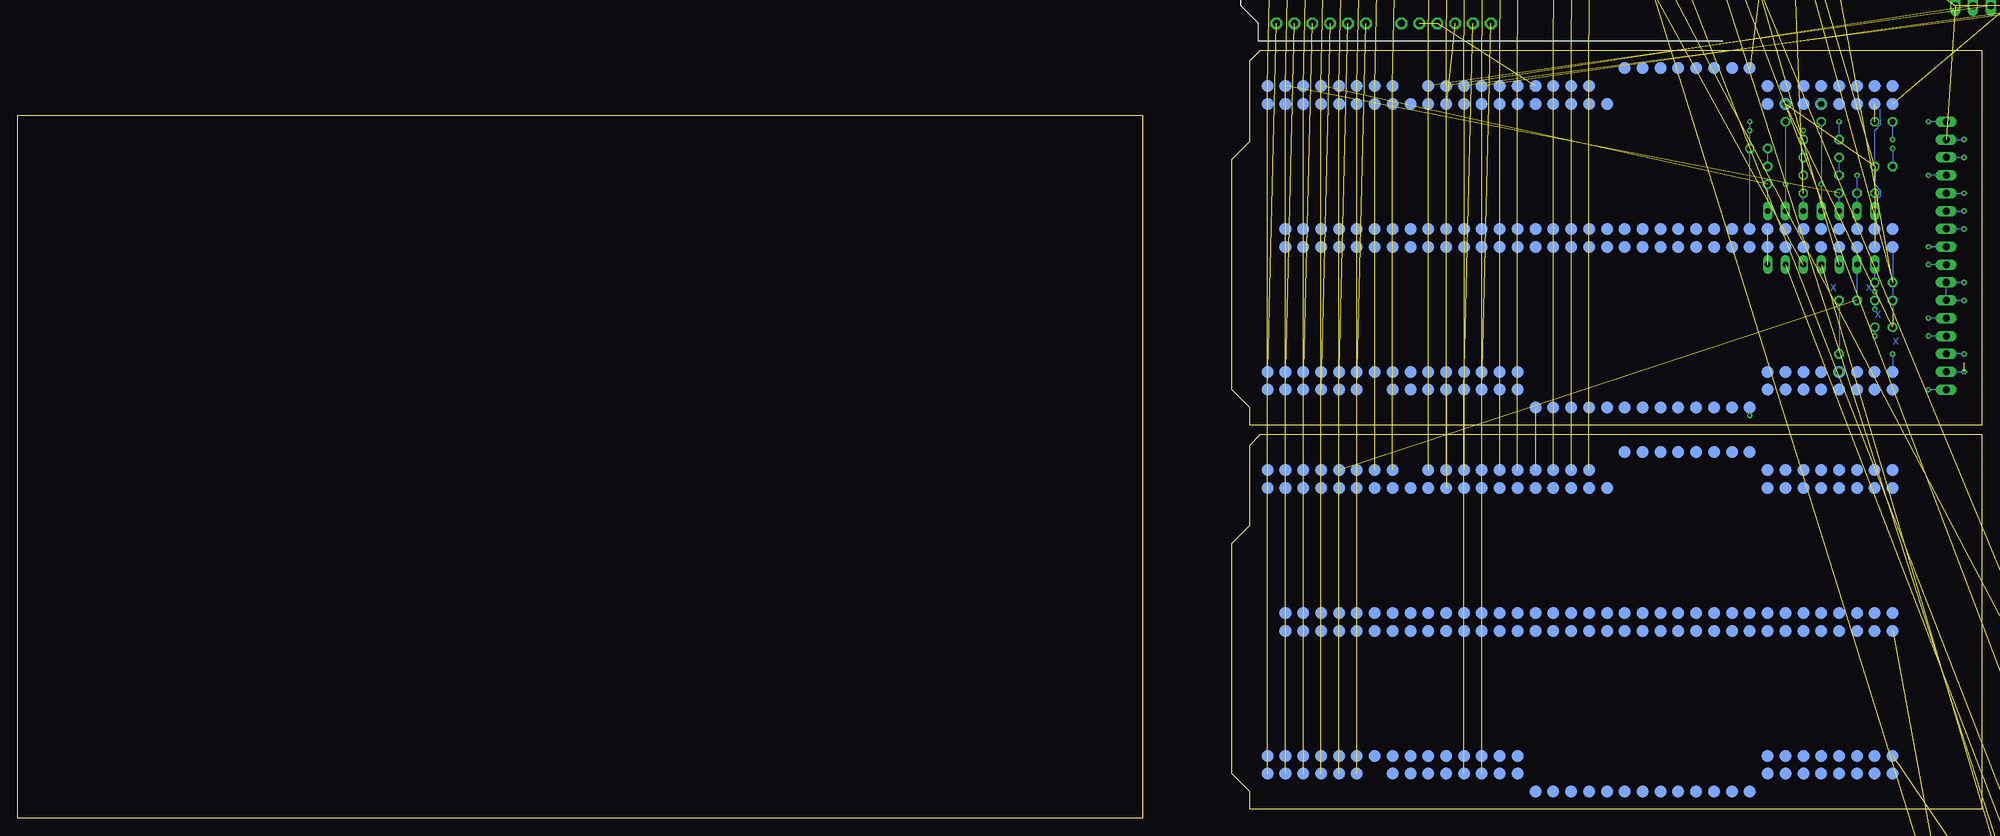
[diagram p6: board, bottom side, seen from below]

Size 279.38 x 109.22 mm. Coordinates in mm from the lower left corner, seen from the top.
Outline: 119.38,0 279.38,0 279.38,100 119.38,100 119.38,0
Copper layers (1*16): Top 0.035mm / dielectric 1.5mm / Bottom 0.035mm
Design rules "default": minimum track width 6mil, minimum drill 0.35mm, track to track 6mil, track to pad 6mil, pad to pad 6mil, via to via 6mil, smd to smd 6mil, copper to edge 40mil, drill to drill 6mil, minimum pad ring 10mil, minimum via ring 8mil, stop-mask expansion 4mil, vias tented up to drill 0mil, thermal gap 10mil

### Footprints (pad centres in the part's own frame; a part is rotated, then mirrored left to right if it is on the bottom)
TT2D4 = drill 0.813: + 0,0 | drill 0.813 octagon: - 2.54,0
C025-024X044 = drill 0.813 octagon: 1 0,0; 2 2.54,0
DIL08-ROUND = drill 0.813 pad 1.676: 1 -3.81,-3.81; 2 -1.27,-3.81; 3 1.27,-3.81; 4 3.81,-3.81; 5 3.81,3.81; 6 1.27,3.81; 7 -1.27,3.81; 8 -3.81,3.81
DIL14 = drill 0.813 long: 1 -7.62,-3.81; 2 -5.08,-3.81; 3 -2.54,-3.81; 4 0,-3.81; 5 2.54,-3.81; 6 5.08,-3.81; 7 7.62,-3.81; 8 7.62,3.81; 9 5.08,3.81; 10 2.54,3.81; 11 0,3.81; 12 -2.54,3.81; 13 -5.08,3.81; 14 -7.62,3.81
LED3MM = drill 0.813 octagon: A -1.27,0; K 1.27,0
LED5MM = drill 0.813 octagon: A -1.27,0; K 1.27,0
IDP_PROTO_LARGE = smd 1.676 x 1.676 bottom: 3V 35.56,5.08; 5V 38.1,5.08; 5V@0 15.24,45.72; 5V@1 17.78,45.72; 5V@2 20.32,45.72; 5V@3 22.86,45.72; 5V@4 25.4,45.72; 5V@5 27.94,45.72; 5V@6 30.48,45.72; 5V@7 33.02,45.72; 5V@8 35.56,45.72; 5V@9 38.1,45.72; 5V@10 40.64,45.72; 5V@11 43.18,45.72; 5V@12 45.72,45.72; 5V@13 48.26,45.72; 5V@14 50.8,45.72; 5V@15 53.34,45.72; 5V@16 55.88,45.72; 5V@17 58.42,45.72; 5V@18 5.08,25.4; 5V@19 7.62,25.4; 5V@20 10.16,25.4; 5V@21 12.7,25.4; 5V@22 15.24,25.4; 5V@23 17.78,25.4; 5V@24 20.32,25.4; 5V@25 22.86,25.4; 5V@26 25.4,25.4; 5V@27 27.94,25.4; 5V@28 30.48,25.4; 5V@29 33.02,25.4; 5V@30 35.56,25.4; 5V@31 38.1,25.4; 5V@32 40.64,25.4; 5V@33 43.18,25.4; 5V@34 45.72,25.4; 5V@35 48.26,25.4; 5V@36 50.8,25.4; 5V@37 53.34,25.4; 5V@38 55.88,25.4; 5V@39 58.42,25.4; 5V@40 60.96,25.4; 5V@41 60.96,45.72; 5V@42 63.5,45.72; 5V@43 2.54,25.4; 5V@44 0,25.4; 5V@45 -2.54,25.4; 5V@46 -5.08,25.4; 5V@47 -7.62,25.4; 5V@48 -10.16,25.4; 5V@49 -12.7,25.4; 5V@50 -15.24,25.4; 5V@51 -17.78,25.4; 5V@52 -20.32,25.4; 5V@53 -22.86,25.4; 5V@54 -25.4,25.4; 5V@55 12.7,50.8; 5V@56 10.16,50.8; 5V@57 7.62,50.8; 5V@58 5.08,50.8; 5V@59 2.54,50.8; 5V@60 0,50.8; 5V@61 -2.54,50.8; 5V@62 -5.08,50.8; 5V@63 -7.62,45.72; 5V@64 -10.16,45.72; 5V@65 -12.7,45.72; 5V@66 -15.24,45.72; 5V@67 -17.78,45.72; 5V@68 -20.32,45.72; 5V@69 -22.86,45.72; 5V@70 -25.4,45.72; A0 50.8,5.08; A1 53.34,5.08; A2 55.88,5.08; A3 58.42,5.08; A4 60.96,5.08; A5 63.5,5.08; AREF 22.86,48.26; D0 63.5,48.26; D1 60.96,48.26; D2 58.42,48.26; D3 55.88,48.26; D4 53.34,48.26; D5 50.8,48.26; D6 48.26,48.26; D7 45.72,48.26; D8 40.64,48.26; D9 38.1,48.26; D10 35.56,48.26; D11 33.02,48.26; D12 30.48,48.26; D13 27.94,48.26; GND 25.4,48.26; GND1 0,2.54; GND2 -2.54,2.54; GND3 -5.08,2.54; GND4 -7.62,7.62; GND5 -10.16,7.62; GND6 -12.7,7.62; GND7 -15.24,7.62; GND8 -17.78,7.62; GND9 -20.32,7.62; GND10 -22.86,7.62; GND11 -25.4,7.62; GND12 2.54,27.94; GND13 0,27.94; GND14 -2.54,27.94; GND15 -5.08,27.94; GND16 2.54,2.54; GND17 5.08,2.54; GND18 7.62,2.54; GND19 10.16,2.54; GND20 12.7,2.54; GND21 15.24,2.54; GND22 17.78,2.54; GND23 20.32,2.54; GND24 22.86,2.54; GND25 25.4,2.54; GND26 -7.62,27.94; GND27 -10.16,27.94; GND28 -12.7,27.94; GND29 -15.24,27.94; GND30 -17.78,27.94; GND31 -20.32,27.94; GND32 -22.86,27.94; GND33 -25.4,27.94; GND@1 43.18,5.08; GND@2 40.64,5.08; GND@3 27.94,7.62; GND@4 30.48,7.62; GND@5 33.02,7.62; GND@6 35.56,7.62; GND@7 38.1,7.62; GND@8 40.64,7.62; GND@9 43.18,7.62; GND@10 45.72,7.62; GND@11 48.26,7.62; GND@12 50.8,7.62; GND@13 53.34,7.62; GND@14 55.88,7.62; GND@15 58.42,7.62; GND@16 60.96,7.62; GND@17 63.5,7.62; GND@26 5.08,27.94; GND@27 7.62,27.94; GND@28 10.16,27.94; GND@29 12.7,27.94; GND@30 15.24,27.94; GND@31 17.78,27.94; GND@32 20.32,27.94; GND@33 22.86,27.94; GND@34 25.4,27.94; GND@35 27.94,27.94; GND@36 30.48,27.94; GND@37 33.02,27.94; GND@38 35.56,27.94; GND@39 38.1,27.94; GND@40 40.64,27.94; GND@41 43.18,27.94; GND@42 45.72,27.94; GND@43 48.26,27.94; GND@44 50.8,27.94; GND@45 53.34,27.94; GND@46 55.88,27.94; GND@47 58.42,27.94; GND@48 60.96,27.94; IOREF 30.48,5.08; RESERVED 27.94,5.08; RESET 33.02,5.08; SCL 17.78,48.26; SDA 20.32,48.26; U1 -25.4,5.08; U2 -22.86,5.08; U3 -20.32,5.08; U4 -17.78,5.08; U5 -15.24,5.08; U6 -12.7,5.08; U7 -10.16,5.08; U8 -7.62,5.08; U9 -25.4,48.26; U10 -22.86,48.26; U11 -20.32,48.26; U12 -17.78,48.26; U13 -15.24,48.26; U14 -12.7,48.26; U15 -10.16,48.26; U16 -7.62,48.26; VIN 45.72,5.08
ARDUINOR3-NOTEXT-NOIOREF = drill 1 pad 1.676 octagon: 3V 35.56,2.54; 5V 38.1,2.54; A0 50.8,2.54; A1 53.34,2.54; A2 55.88,2.54; A3 58.42,2.54; A4 60.96,2.54; A5 63.5,2.54; AREF 23.876,50.8; D0 63.5,50.8; D1 60.96,50.8; D2 58.42,50.8; D3 55.88,50.8; D4 53.34,50.8; D5 50.8,50.8; D6 48.26,50.8; D7 45.72,50.8; D8 41.656,50.8; D9 39.116,50.8; D10 36.576,50.8; D11 34.036,50.8; D12 31.496,50.8; D13 28.956,50.8; GND 26.416,50.8; GND1 43.18,2.54; GND2 40.64,2.54; RESET 33.02,2.54; SCL 18.796,50.8; SDA 21.336,50.8; VIN 45.72,2.54
0204V = drill 0.813 octagon: 1 -1.27,0; 2 1.27,0
N14 = drill 0.787 pad 1.295 square: 1 -7.62,15.24 | drill 0.787 pad 1.295: 2 -7.62,12.7; 3 -7.62,10.16; 4 -7.62,7.62; 5 -7.62,5.08; 6 -7.62,2.54; 7 -7.62,0; 8 0,0; 9 0,2.54; 10 0,5.08; 11 0,7.62; 12 0,10.16; 13 0,12.7; 14 0,15.24
22-23-2041 = drill 1 long: 1 -3.81,0; 2 -1.27,0; 3 1.27,0; 4 3.81,0
KK-156-2 = drill 1.7 pad 2.184 long: 1 -1.98,0; 2 1.98,0
TRIM_3296W-1-250 = drill 0.74 square: 1 -2.54,0 | drill 0.74: 2 0,0; 3 2.54,0

### Placement (x,y rotation side)
C1  -8.89,177.8 0 top  (outside the outline)
C2  8.89,179.07 0 top  (outside the outline)
C3  13.97,179.07 0 top  (outside the outline)
C4  3.81,179.07 0 top  (outside the outline)
C5  -1.27,179.07 0 top  (outside the outline)
IC1  26.67,130.81 180 top  (outside the outline)
IC2  22.86,82.55 0 top
IC3  39.37,121.92 0 top  (outside the outline)
LED1  53.34,186.69 0 top  (outside the outline)
LED2  20.32,95.25 90 top
LED3  25.4,95.25 90 top
LED4  31.75,95.25 0 top
LED5  20.32,64.77 270 top
LED6  1.27,-38.1 0 top  (outside the outline)
LED7  -12.7,-26.67 0 top  (outside the outline)
LED8  -34.29,-38.1 0 top  (outside the outline)
LED9  -16.51,-38.1 0 top  (outside the outline)
M1  38.1,1.27 0 top
M2  38.1,55.88 0 top
Q1  36.83,110.49 0 top  (outside the outline)
R1  41.91,186.69 0 top  (outside the outline)
R2  31.75,186.69 0 top  (outside the outline)
R3  13.97,99.06 0 top
R4  11.43,186.69 0 top  (outside the outline)
R5  1.27,186.69 0 top  (outside the outline)
R6  16.51,88.9 180 top
R7  20.32,90.17 270 top
R8  13.97,73.66 180 top
R9  22.86,100.33 90 top
R10  25.4,90.17 270 top
R11  13.97,69.85 180 top
R12  27.94,100.33 90 top
R13  30.48,91.44 270 top
R14  13.97,92.71 0 top
R15  13.97,76.2 180 top
R16  19.05,73.66 180 top
R17  -36.83,-44.45 0 top  (outside the outline)
R18  -26.67,-44.45 0 top  (outside the outline)
R19  -16.51,-44.45 0 top  (outside the outline)
R20  -6.35,-44.45 0 top  (outside the outline)
R21  -36.83,-49.53 0 top  (outside the outline)
R22  -26.67,-49.53 0 top  (outside the outline)
R23  -16.51,-49.53 0 top  (outside the outline)
R24  -6.35,-49.53 0 top  (outside the outline)
R25  -36.83,-54.61 0 top  (outside the outline)
R26  -26.67,-54.61 0 top  (outside the outline)
R27  -16.51,-54.61 0 top  (outside the outline)
R28  -6.35,-54.61 0 top  (outside the outline)
R29  -36.83,-59.69 0 top  (outside the outline)
R30  -26.67,-59.69 0 top  (outside the outline)
U1  17.78,147.32 270 top  (outside the outline)
U2  0,115.57 0 top  (outside the outline)
U3  5.08,95.25 270 top
U4  5.08,64.77 270 top
U5  5.08,85.09 270 top
U6  -11.43,115.57 0 top  (outside the outline)
U7  5.08,74.93 90 top
U$1  -10.16,-17.78 0 top  (outside the outline)
U$2  2.54,-17.78 0 top  (outside the outline)
VR1  -33.02,-29.21 0 top  (outside the outline)
VR2  -21.59,-29.21 0 top  (outside the outline)

### Tracks (layer width: path | path; a pad name or v marks a point on that pad's centre or on a via)
+3V3  (2 unrouted)
+5V  (27 unrouted)
  Bottom 0.152: M2.5V@54 12.7,70.1
A0  (2 unrouted)
A1  (2 unrouted)
A2  (2 unrouted)
A3  (2 unrouted)
A4_SDA  (2 unrouted)
A5_SCL  (2 unrouted)
AREF  (2 unrouted)
D0  (2 unrouted)
D1  (3 unrouted)
  Bottom 0.152: IC2.12 R7.2
D2  (4 unrouted)
  Bottom 0.152: IC2.10 R10.2
D3  (3 unrouted)
  Bottom 0.152: IC2.8 R13.2
D4  (3 unrouted)
  Bottom 0.152: IC2.2 R16.2
D5  (2 unrouted)
D6  (2 unrouted)
D7  (2 unrouted)
D8  (3 unrouted)
D9  (3 unrouted)
D10  (3 unrouted)
D11  (3 unrouted)
D12  (2 unrouted)
D13  (2 unrouted)
DIS  (2 unrouted)
GND  (via drill 0.35)  (26 unrouted)
  Top 0.152: 10.16,66.04 v12.7,66.04 | v2.54,96.52 2.54,95.25 | 2.54,95.25 v2.54,93.98 | 2.54,95.25 1.09,95.25 1.09,85.09 | 1.09,85.09 1.09,74.93 | 1.09,74.93 1.09,64.77 | 1.09,64.77 1.09,57.15 32.9,57.15 v33.02,57.27 | v2.54,86.36 2.54,85.09 | 2.54,85.09 v2.54,83.82 | 2.54,85.09 1.09,85.09 | 2.54,74.93 1.09,74.93 | 1.09,64.77 2.54,64.77 | v2.54,73.66 2.54,74.93 | v2.54,76.2 2.54,74.93 | v25.4,97.79 v33.02,97.79 | v20.32,99.06 21.6,99.06 22.49,99.95 28.31,99.95 29.2,99.06 v33.02,99.06 | v2.54,63.5 v2.54,66.04
  Bottom 0.152: v12.7,66.04 M2.GND11 | v33.02,57.27 M2.GND3 | 4.89,86.36 v2.54,86.36 U5.2 | M2.GND15 LED4.K v33.02,97.79 v33.02,99.06 | LED3.K v25.4,97.79 | LED2.K v20.32,99.06 | U3.2 v2.54,96.52 | U3.3 v2.54,93.98 | U5.3 v2.54,83.82 | v2.54,73.66 U7.2 U7.3 v2.54,76.2 | U4.3 v2.54,63.5 | v2.54,66.04 U4.2
LED_2HZ  (1 unrouted)
N$1  (2 unrouted)
N$2  (via drill 0.35)
  Top 0.152: v7.62,99.06 10.16,99.06 v12.7,96.52
  Bottom 0.152: v12.7,96.52 R3.1 | U3.1 v7.62,99.06
N$3  (1 unrouted)
N$4
  Bottom 0.152: R7.1 LED2.A
N$5  (via drill 0.35)
  Top 0.152: v7.62,91.44 v17.78,91.44
  Bottom 0.152: v17.78,91.44 R6.1 IC2.13 | U3.4 v7.62,91.44
N$6  (via drill 0.35)
  Top 0.152: v7.62,71.12 8.89,72.39 v15.24,72.39
  Bottom 0.152: v15.24,72.39 R8.1 | U7.1 v7.62,71.12
N$7  (via drill 0.35)
  Top 0.152: v7.62,78.74 7.62,80.42 7.01,81.03 7.01,81.53 10.29,84.81 15.61,84.81 16.89,86.09 16.89,89.27 17.79,90.17 v22.86,90.17
  Bottom 0.152: R9.1 v22.86,90.17 IC2.11 | U7.4 v7.62,78.74
N$8
  Bottom 0.152: R10.1 LED3.A
N$9  (via drill 0.35)
  Top 0.152: v7.62,68.58 v15.24,68.58
  Bottom 0.152: v15.24,68.58 R11.1 | U4.1 v7.62,68.58
N$10  (via drill 0.35)
  Top 0.152: v27.94,90.17 27.94,81.28 26.29,79.63 26.29,77.71 14.01,65.43 12.09,65.43 v7.62,60.96
  Bottom 0.152: R12.1 v27.94,90.17 IC2.9 | U4.4 v7.62,60.96
N$11
  Bottom 0.152: R13.1 LED4.A
N$12  (via drill 0.35)
  Top 0.152: v2.54,88.9 2.54,92.71 3.33,93.5 3.33,94.39 4.19,95.25 v12.7,95.25
  Bottom 0.152: 4.89,88.9 v2.54,88.9 U5.1 | v12.7,95.25 R14.1
N$13  (via drill 0.35)
  Top 0.152: v7.62,81.28 11.81,77.09 11.81,75.83 12.33,75.31 14.86,75.31 v15.24,74.93
  Bottom 0.152: IC2.1 R15.1 v15.24,74.93 | 5.27,81.28 v7.62,81.28 U5.4
N$14
  Bottom 0.152: R16.1 LED5.A
N$15  (1 unrouted)
N$16  (2 unrouted)
N$17  (2 unrouted)
N$18  (1 unrouted)
N$19  (3 unrouted)
N$20  (1 unrouted)
N$21  (1 unrouted)
N$22  (1 unrouted)
N$23  (1 unrouted)
N$24  (2 unrouted)
N$25  (2 unrouted)
N$26  (1 unrouted)
N$27  (3 unrouted)
N$28  (1 unrouted)
N$29  (1 unrouted)
N$30  (1 unrouted)
OUT  (2 unrouted)
RESET  (2 unrouted)
SCL  (2 unrouted)
SDA  (2 unrouted)
VCC
  Bottom 0.152: 14.49,100.85 14.49,99.56 14.35,99.43 14.35,98.69 15.24,97.8 15.24,90.16 14.35,89.27 14.35,88.53 15.24,87.64 IC2.14

### Text on the board
Bottom: x | x | x | x